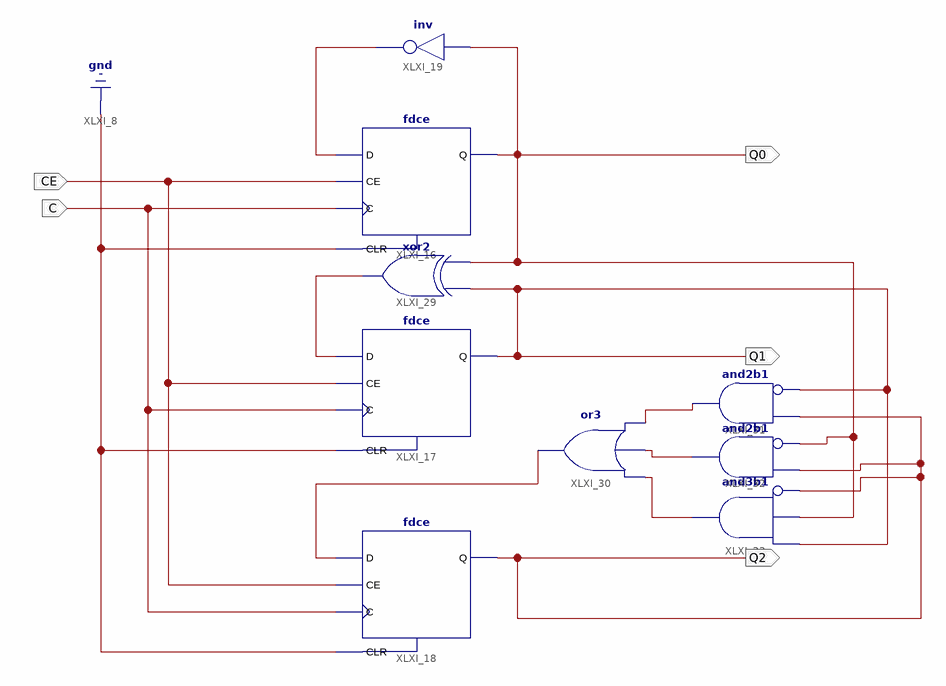
[diagram p0: schematic sheet 1]
// Xilinx ISE schematic counter.sch (xc9500xl) as structural Verilog: 9 symbols, 5 ports
module counter (
  input  C,
  input  CE,
  output Q2,
  output Q1,
  output Q0
);

  wire XLXN_44, XLXN_50, XLXN_51, XLXN_53, XLXN_54, XLXN_60;

  fdce XLXI_16 (.C(C), .CE(CE), .CLR(1'b0), .D(XLXN_44), .Q(Q0));
  fdce XLXI_17 (.C(C), .CE(CE), .CLR(1'b0), .D(XLXN_50), .Q(Q1));
  fdce XLXI_18 (.C(C), .CE(CE), .CLR(1'b0), .D(XLXN_60), .Q(Q2));
  not XLXI_19 (XLXN_44, Q0);
  xor XLXI_29 (XLXN_50, Q0, Q1);
  or XLXI_30 (XLXN_60, XLXN_51, XLXN_54, XLXN_53);
  and XLXI_32 (XLXN_54, ~Q0, Q2);  // and2b1
  and XLXI_31 (XLXN_51, ~Q1, Q2);  // and2b1
  and XLXI_33 (XLXN_53, ~Q2, Q0, Q1);  // and3b1
endmodule
